# Altium schematic sheet SOM_JB1.SchDoc: SoM TE0720 JB1
size 420 x 297 mm; Author: P. Zdunek; DrawnBy: P. Zdunek; Organization: Altium Limited; Address1: L3, 12a Rodborough Rd; Address2: Frenchs Forest; Address3: NSW; Address4: Australia 2086; DocumentNumber: 3; SheetNumber: 3; SheetTotal: 37; ModifiedBy: -; CheckedDate: -; Title2: Fast Stabilizer; DivGrp: WUT ISE; Designer: G.Kasprowicz
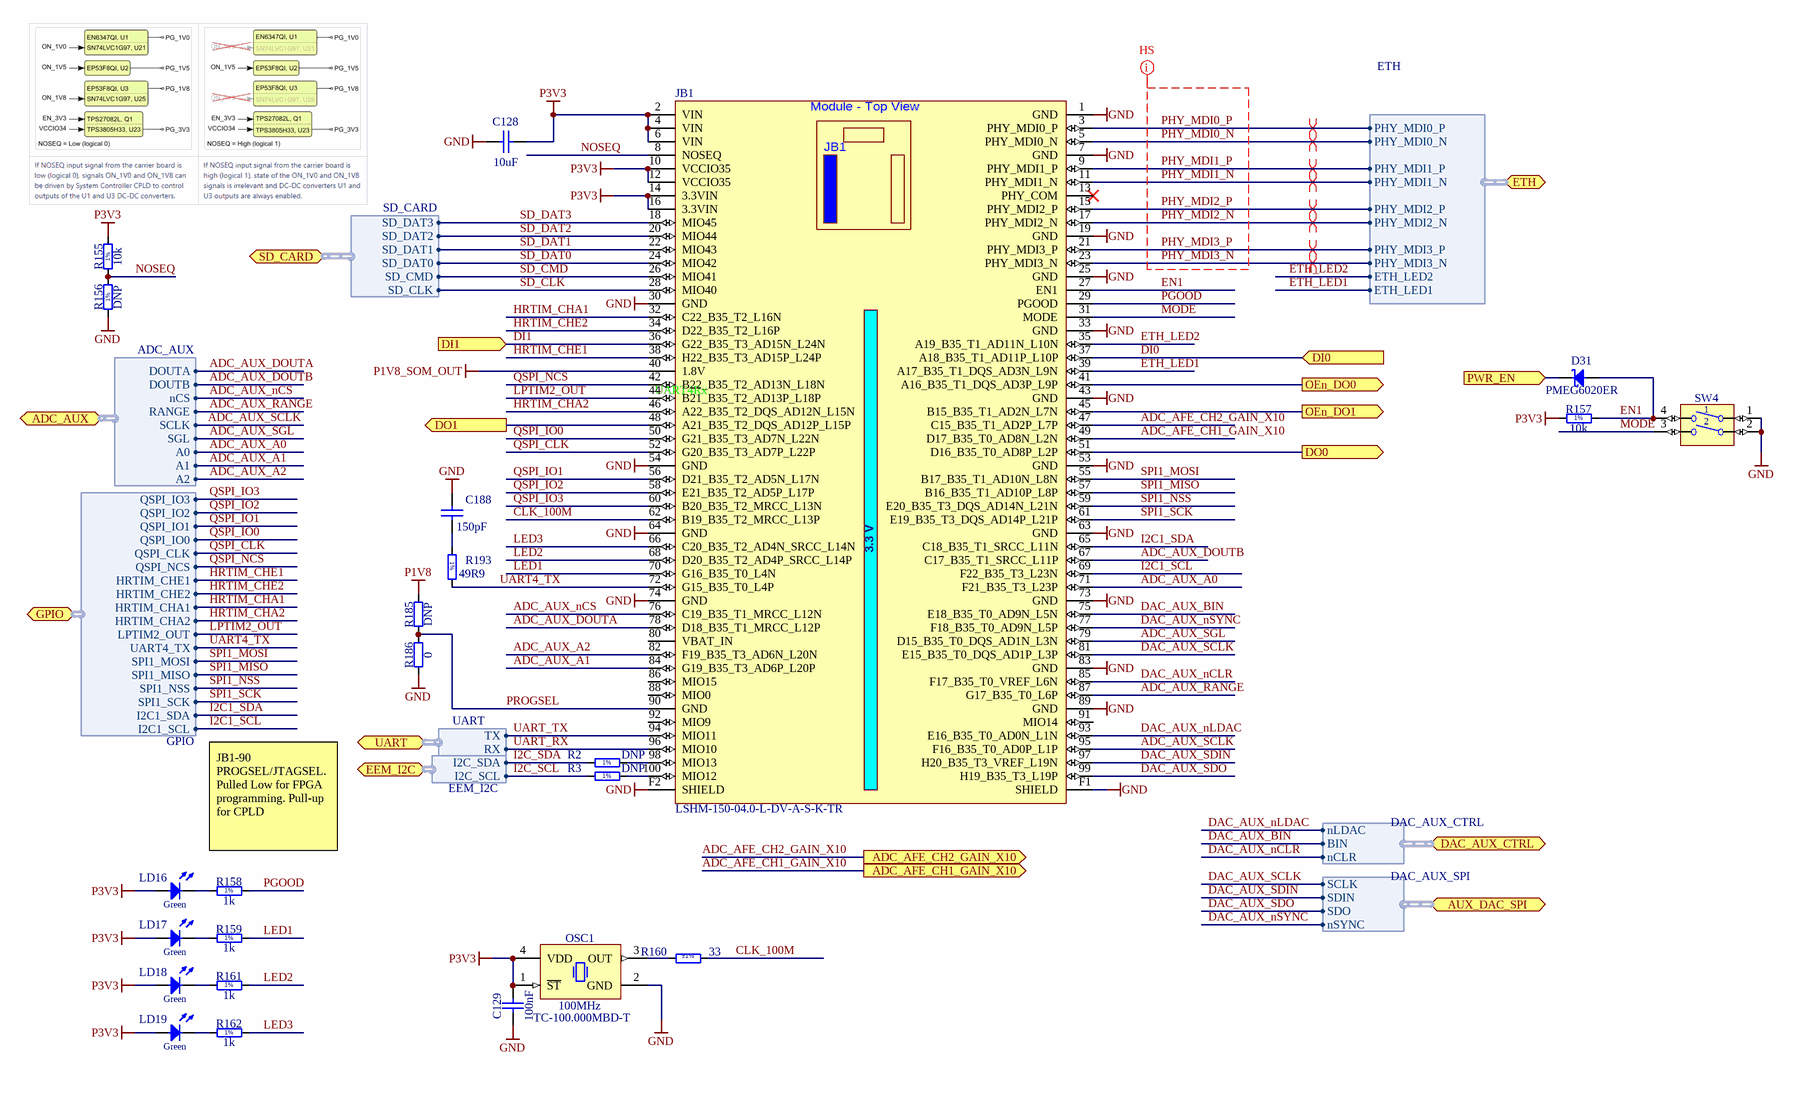
[diagram p0: SOM_JB1.SchDoc]

## Parts
C128  10uF  [CAPC1608X80N]
C129  100nF  [CAPC1005X55N]
C188  150pF  [CAPC1005X55N]
D31  PMEG6020ER  [SODFL3517X110N]
JB1  LSHM-150-04.0-L-DV-A-S-K-TR  [LSHM-150-XXX-X-DV-A-X]
LD16  Green  [LED_KINGBRIGHT_KPH-1608CGCK]
LD17  Green  [LED_KINGBRIGHT_KPH-1608CGCK]
LD18  Green  [LED_KINGBRIGHT_KPH-1608CGCK]
LD19  Green  [LED_KINGBRIGHT_KPH-1608CGCK]
OSC1  100MHz  Manufacturer Part Number: TC-100.000MBD-T  [OSC_CDFN3225-4LD-PL-1]
R2  DNP  [RESC1005X40N]
R3  DNP  [RESC1005X40N]
R155  10k  [RESC1005X40N]
R156  DNP  [RESC1005X40N]
R157  10k  [RESC1005X40N]
R158  1k  [RESC1005X40N]
R159  1k  [RESC1005X40N]
R160  33  Tolerance: ±1%  [RESC1005X40N]
R161  1k  [RESC1005X40N]
R162  1k  [RESC1005X40N]
R185  DNP  [RESC1005X40N]
R186  0  [RESC1005X40N]
R193  49R9  [RESC1005X40N]
SW4  Switch  [SW_OMRON_A6SN-2101]  (value not drawn)

## Ports
ADC_AFE_CH1_GAIN_X10 (out), ADC_AFE_CH2_GAIN_X10 (out), ADC_AUX (bidir, harness ADC_AUX), AUX_DAC_SPI (bidir, harness DAC_AUX_SPI), DAC_AUX_CTRL (bidir, harness DAC_AUX_CTRL), DI0 (in), DI1 (in), DO0 (out), DO1 (out), EEM_I2C (bidir, harness EEM_I2C), ETH (bidir, harness ETH), GPIO (bidir, harness GPIO), OEn_DO0 (out), OEn_DO1 (out), PWR_EN (in), SD_CARD (bidir, harness SD_CARD), UART (bidir, harness UART)

## Harnesses
ETH: PHY_MDI0_P, PHY_MDI0_N, PHY_MDI1_P, PHY_MDI1_N, PHY_MDI2_P, PHY_MDI2_N, PHY_MDI3_P, PHY_MDI3_N, ETH_LED2, ETH_LED1
SD_CARD: SD_DAT3, SD_DAT2, SD_DAT1, SD_DAT0, SD_CMD, SD_CLK
EEM_I2C: I2C_SDA, I2C_SCL
UART: TX, RX
ADC_AUX: SCLK, SGL, DOUTA, DOUTB, nCS, RANGE, A0, A1, A2
GPIO: QSPI_IO3, QSPI_IO2, QSPI_IO1, QSPI_IO0, QSPI_CLK, QSPI_NCS, HRTIM_CHE1, HRTIM_CHE2, HRTIM_CHA1, HRTIM_CHA2, LPTIM2_OUT, UART4_TX, SPI1_MOSI, SPI1_MISO, SPI1_NSS, SPI1_SCK, I2C1_SDA, I2C1_SCL
DAC_AUX_SPI: SCLK, SDIN, SDO, nSYNC
DAC_AUX_CTRL: nCLR, BIN, nLDAC

## Nets
GND: C128.2 C129.1 C188.2 JB1.1(GND) JB1.7(GND) JB1.19(GND) JB1.25(GND) JB1.30(GND) JB1.33(GND) JB1.43(GND) JB1.53(GND) JB1.54(GND) JB1.63(GND) JB1.64(GND) JB1.73(GND) JB1.74(GND) JB1.83(GND) JB1.89(GND) JB1.F1(SHIELD) JB1.F2(SHIELD) OSC1.2(GND) R156.1 R186.1 SW4.1 SW4.2
P1V8: R185.2
P1V8_SOM_OUT: JB1.40(1.8V)
P3V3: C128.1 C129.2 JB1.2(VIN) JB1.4(VIN) JB1.6(VIN) JB1.10(VCCIO35) JB1.12(VCCIO35) JB1.14(3.3VIN) JB1.16(3.3VIN) LD16.2(A) LD17.2(A) LD18.2(A) LD19.2(A) OSC1.1(~{ST}) OSC1.4(VDD) R155.2 R157.2
ADC_AFE_CH1_GAIN_X10: JB1.49(D17_B35_T0_AD8N_L2N) ; port ADC_AFE_CH1_GAIN_X10
ADC_AFE_CH2_GAIN_X10: JB1.47(C15_B35_T1_AD2P_L7P) ; port ADC_AFE_CH2_GAIN_X10
ADC_AUX_A0: JB1.71(F21_B35_T3_L23P) ; port ADC_AUX.A0
ADC_AUX_A1: JB1.84(G19_B35_T3_AD6P_L20P) ; port ADC_AUX.A1
ADC_AUX_A2: JB1.82(F19_B35_T3_AD6N_L20N) ; port ADC_AUX.A2
ADC_AUX_DOUTA: JB1.78(D18_B35_T1_MRCC_L12P) ; port ADC_AUX.DOUTA
ADC_AUX_DOUTB: JB1.67(C17_B35_T1_SRCC_L11P) ; port ADC_AUX.DOUTB
ADC_AUX_nCS: JB1.76(C19_B35_T1_MRCC_L12N) ; port ADC_AUX.nCS
ADC_AUX_RANGE: JB1.87(G17_B35_T0_L6P) ; port ADC_AUX.RANGE
ADC_AUX_SCLK: JB1.95(F16_B35_T0_AD0P_L1P) ; port ADC_AUX.SCLK
ADC_AUX_SGL: JB1.79(D15_B35_T0_DQS_AD1N_L3N) ; port ADC_AUX.SGL
CLK_100M: JB1.62(B19_B35_T2_MRCC_L13P) R160.2
DAC_AUX_BIN: JB1.75(E18_B35_T0_AD9N_L5N) ; port DAC_AUX_CTRL.BIN
DAC_AUX_nCLR: JB1.85(F17_B35_T0_VREF_L6N) ; port DAC_AUX_CTRL.nCLR
DAC_AUX_nLDAC: JB1.93(E16_B35_T0_AD0N_L1N) ; port DAC_AUX_CTRL.nLDAC
DAC_AUX_nSYNC: JB1.77(F18_B35_T0_AD9N_L5P) ; port AUX_DAC_SPI.nSYNC
DAC_AUX_SCLK: JB1.81(E15_B35_T0_DQS_AD1P_L3P) ; port AUX_DAC_SPI.SCLK
DAC_AUX_SDIN: JB1.97(H20_B35_T3_VREF_L19N) ; port AUX_DAC_SPI.SDIN
DAC_AUX_SDO: JB1.99(H19_B35_T3_L19P) ; port AUX_DAC_SPI.SDO
DI0: JB1.37(A18_B35_T1_AD11P_L10P) ; port DI0
DI1: JB1.36(G22_B35_T3_AD15N_L24N) ; port DI1
DO0: JB1.51(D16_B35_T0_AD8P_L2P) ; port DO0
DO1: JB1.48(A21_B35_T2_DQS_AD12P_L15P) ; port DO1
EN1: D31.2(A) JB1.27(EN1) R157.1 SW4.4
ETH_LED1: JB1.39(A17_B35_T1_DQS_AD3N_L9N) ; port ETH.ETH_LED1
ETH_LED2: JB1.35(A19_B35_T1_AD11N_L10N) ; port ETH.ETH_LED2
HRTIM_CHA1: JB1.32(C22_B35_T2_L16N) ; port GPIO.HRTIM_CHA1
HRTIM_CHA2: JB1.46(A22_B35_T2_DQS_AD12N_L15N) ; port GPIO.HRTIM_CHA2
HRTIM_CHE1: JB1.38(H22_B35_T3_AD15P_L24P) ; port GPIO.HRTIM_CHE1
HRTIM_CHE2: JB1.34(D22_B35_T2_L16P) ; port GPIO.HRTIM_CHE2
I2C1_SCL: JB1.69(F22_B35_T3_L23N) ; port GPIO.I2C1_SCL
I2C1_SDA: JB1.65(C18_B35_T1_SRCC_L11N) ; port GPIO.I2C1_SDA
I2C_SCL: R3.1 ; port EEM_I2C.I2C_SCL
I2C_SDA: R2.1 ; port EEM_I2C.I2C_SDA
LED1: JB1.70(G16_B35_T0_L4N) R159.2
LED2: JB1.68(D20_B35_T2_AD4P_SRCC_L14P) R161.2
LED3: JB1.66(C20_B35_T2_AD4N_SRCC_L14N) R162.2
LPTIM2_OUT: JB1.44(B21_B35_T2_AD13P_L18P) ; port GPIO.LPTIM2_OUT
MODE: JB1.31(MODE) SW4.3
NOSEQ: JB1.8(NOSEQ) R155.1 R156.2
OEn_DO0: JB1.41(A16_B35_T1_DQS_AD3P_L9P) ; port OEn_DO0
OEn_DO1: JB1.45(B15_B35_T1_AD2N_L7N) ; port OEn_DO1
PGOOD: JB1.29(PGOOD) R158.2
PHY_MDI0_N: JB1.5(PHY_MDI0_N) ; port ETH.PHY_MDI0_N
PHY_MDI0_P: JB1.3(PHY_MDI0_P) ; port ETH.PHY_MDI0_P
PHY_MDI1_N: JB1.11(PHY_MDI1_N) ; port ETH.PHY_MDI1_N
PHY_MDI1_P: JB1.9(PHY_MDI1_P) ; port ETH.PHY_MDI1_P
PHY_MDI2_N: JB1.17(PHY_MDI2_N) ; port ETH.PHY_MDI2_N
PHY_MDI2_P: JB1.15(PHY_MDI2_P) ; port ETH.PHY_MDI2_P
PHY_MDI3_N: JB1.23(PHY_MDI3_N) ; port ETH.PHY_MDI3_N
PHY_MDI3_P: JB1.21(PHY_MDI3_P) ; port ETH.PHY_MDI3_P
PROGSEL: JB1.90(GND) R185.1 R186.2
PWR_EN: D31.1(C) ; port PWR_EN
QSPI_CLK: JB1.52(G20_B35_T3_AD7P_L22P) ; port GPIO.QSPI_CLK
QSPI_IO0: JB1.50(G21_B35_T3_AD7N_L22N) ; port GPIO.QSPI_IO0
QSPI_IO1: JB1.56(D21_B35_T2_AD5N_L17N) ; port GPIO.QSPI_IO1
QSPI_IO2: JB1.58(E21_B35_T2_AD5P_L17P) ; port GPIO.QSPI_IO2
QSPI_IO3: JB1.60(B20_B35_T2_MRCC_L13N) ; port GPIO.QSPI_IO3
QSPI_NCS: JB1.42(B22_B35_T2_AD13N_L18N) ; port GPIO.QSPI_NCS
SD_CLK: JB1.28(MIO40) ; port SD_CARD.SD_CLK
SD_CMD: JB1.26(MIO41) ; port SD_CARD.SD_CMD
SD_DAT0: JB1.24(MIO42) ; port SD_CARD.SD_DAT0
SD_DAT1: JB1.22(MIO43) ; port SD_CARD.SD_DAT1
SD_DAT2: JB1.20(MIO44) ; port SD_CARD.SD_DAT2
SD_DAT3: JB1.18(MIO45) ; port SD_CARD.SD_DAT3
SPI1_MISO: JB1.57(B16_B35_T1_AD10P_L8P) ; port GPIO.SPI1_MISO
SPI1_MOSI: JB1.55(B17_B35_T1_AD10N_L8N) ; port GPIO.SPI1_MOSI
SPI1_NSS: JB1.59(E20_B35_T3_DQS_AD14N_L21N) ; port GPIO.SPI1_NSS
SPI1_SCK: JB1.61(E19_B35_T3_DQS_AD14P_L21P) ; port GPIO.SPI1_SCK
UART4_TX: JB1.72(G15_B35_T0_L4P) R193.2 ; port GPIO.UART4_TX
UART_RX: JB1.96(MIO10) ; port UART.RX
UART_TX: JB1.94(MIO11) ; port UART.TX
NetC188_1: C188.1 R193.1
NetJB1_98: JB1.98(MIO13) R2.2
NetJB1_100: JB1.100(MIO12) R3.2
NetLD16_1: LD16.1(C) R158.1
NetLD17_1: LD17.1(C) R159.1
NetLD18_1: LD18.1(C) R161.1
NetLD19_1: LD19.1(C) R162.1
NetOSC1_3: OSC1.3(OUT) R160.1

Not connected (* = marked no-connect by the designer): JB1 13(PHY_COM)* 80(VBAT_IN) 86(MIO15) 88(MIO0) 91(MIO14) 92(MIO9)

## Layout directives
differential pair: PHY_MDI0_N, PHY_MDI0_P, PHY_MDI1_N, PHY_MDI1_P, PHY_MDI2_N, PHY_MDI2_P, PHY_MDI3_N, PHY_MDI3_P
net class HIGH_SPEED: PHY_MDI0_N, PHY_MDI0_P, PHY_MDI1_N, PHY_MDI1_P, PHY_MDI2_N, PHY_MDI2_P, PHY_MDI3_N, PHY_MDI3_P

## Notes on the sheet
- (near JB1) UART4Rx
- (near JB1) 3.3 V
- JB1-90 PROGSEL/JTAGSEL. Pulled Low for FPGA programming. Pull-up for CPLD
- Project/Equipment
- Document
- Designer
- Drawn by
- Check.by
- Copyright WUT ISE 2020.
  This documentation describes Open Hardware and is licensed under the CERN OHL v.1.2. You may redistribute and modify this documentation under the terms of the CERN OHL v.1.2. (http://ohwr.org/CERNOHL). This documentation is distributed WITHOUT ANY EXPRESS OR IMPLIED WARRANTY, INCLUDING OF MERCHANTABILITY, SATISFACTORY QUALITY AND FITNESS FOR A PARTICULAR PURPOSE. Please see the CERN OHL v.1.2 for applicable conditions.
- Contact
- File
- Last Mod.
- Print Date
- Sheet
- Size
- A3
- of
- Rev
- (in symbol 25285) Module - Top View
- (in symbol R0402_1K_1%_0.0625W_100PPM) 1%
- (in symbol R0402_2K4_1%_0.0625W_100PPM) 1%
- (in symbol R0402_10K_1%_0.0625W_100PPM) 1%
- (in symbol R0402_49R9_1%_0.0625W_100PPM) 1%

## Library data of the parts
C128 = CC0603_10UF_10V_10%_X5R: Non-polarised capacitor; Part Description: SMD Multilayer Chip Ceramic Capacitor; Manufacturer: GENERIC; Manufacturer1 Part Number: GRM188R61A106KE69D; Voltage: 10V; TC: X5R; Tolerance: ±10%; Part Number: CC0603_10UF_10V_10%_X5R; Component Kind: Standard; Component Type: Standard; Pin Count: 2; Value: 10uF; Status: None; Manufacturer Part Number: CC0603_10UF_10V_10%_X5R; Case: 0603; Mounted: Yes; Socket: No; SMD: Yes; Sense: No; Manufacturer1 Example: MURATA; Manufacturer1 ComponentHeight: 0.8mm; HelpURL: \\cern.ch\dfs\Applications\Altium\Datasheets\CC0603_MURATA_GRM188R61A106KE69D.pdf; Author: CERN DEM JLC; CreateDate: 31/01/2017; LatestRevisionDate: 31/01/2017
C129 = CC0402_100NF_16V_10%_X5R: Non-polarised capacitor; Manufacturer: GENERIC; Part Description: SMD Multilayer Chip Ceramic Capacitor; Manufacturer1 Part Number: GRM155R61C104KA88D; Voltage: 16V; TC: X5R; Tolerance: ±10%; Part Number: CC0402_100NF_16V_10%_X5R; Component Kind: Standard; Component Type: Standard; Pin Count: 2; Value: 100nF; Status: None; Manufacturer Part Number: CC0402_100NF_16V_10%_X5R; Case: 0402; Mounted: Yes; Socket: No; SMD: Yes; Sense: No; Manufacturer1 Example: MURATA; Manufacturer1 ComponentHeight: 0.55mm; HelpURL: \\cern.ch\dfs\Applications\Altium\Datasheets\CC0402_X5R_MURATA_GRM.pdf; Author: CERN DEM JLC; CreateDate: 10/12/2013; LatestRevisionDate: 10/12/2013
C188 = CC0402_150PF_50V_5%_C0G: Non-polarised capacitor; Part Description: SMD Multilayer Chip Ceramic Capacitor; Manufacturer: GENERIC; Manufacturer1 Part Number: C0402C151J5GACTU; Voltage: 50V; TC: C0G/NP0; Tolerance: ±5%; Part Number: CC0402_150PF_50V_5%_C0G; Component Kind: Standard; Component Type: Standard; Pin Count: 2; Value: 150pF; Status: Preferred; Manufacturer Part Number: CC0402_150PF_50V_5%_C0G; Case: 0402; Mounted: Yes; Socket: No; SMD: Yes; Sense: No; Manufacturer1 Example: KEMET; Manufacturer1 ComponentHeight: 0.55mm; HelpURL: \\cern.ch\dfs\Applications\Altium\Datasheets\CC0402_C0G_KEMET_(Commercial Grade).pdf; Author: CERN DEM JLC; CreateDate: 03.12.2007; LatestRevisionDate: 22.04.2015
D31 = PMEG6020ER: Schottky Diode; Part Description: MEGA Schottky Barrier Rectifier; Manufacturer: NXP SEMICONDUCTORS; Voltage: 60V; Power: 2A; PressFit: No; Bonding: No; Part Number: PMEG6020ER; Component Kind: Standard; Component Type: Standard; Device: PMEG6020ER; PackageDescription: SODFL Diode (SOD123W); 2.60mm W X 1.70mm L X 1.10mm H body, IPC Medium Density; Manufacturer Part Number: PMEG6020ER; Pin Count: 2; Case: SOD-123FL; Mounted: Yes; Socket: No; SMD: Yes; Sense: No; ComponentHeight: 1.1mm; HelpURL: \\cern.ch\dfs\Applications\Altium\Datasheets\PMEG6020ER.pdf; Author: CERN DEM JMW; CreateDate: 19.06.2014; LatestRevisionDate: 19.06.2014
JB1 = 25285: Samtec Razor Beam REF-189016-02, LF-04.0, 100 Pins, für alle 4x5 SoMs; Mixed: SMT; Trenz-Stock: Yes; Trenz-Article-Number: 23838; AN: 25285; Part Number: LSHM-150-04.0-L-DV-A-S-K-TR
LD16-LD19 = LED_KINGBRIGHT_KPH-1608CGCK: LED Green 1C 2A; Part Description: SMD Green LED, Case 1.6mmX0.8mm(0603), 0.65mm Thickness; PressFit: No; Bonding: No; Part Number: LED_KINGBRIGHT_KPH-1608CGCK; Component Kind: Standard; Component Type: Standard; Color: Green; PackageDescription: SMT Green LED, Case 0603, Body L 1.6 x W 0.8mm H 0.65mm; Manufacturer: KINGBRIGHT; Manufacturer Part Number: KPH-1608CGCK; Pin Count: 2; Mounted: Yes; Socket: No; SMD: Yes; Sense: No; ComponentHeight: 0.65mm; HelpURL: \\cern.ch\dfs\Applications\Altium\Datasheets\LED_KINGBRIGHT_KPH-1608CGCK.pdf; Author: CERN DEM JLC; CreateDate: 03/07/2017; LatestRevisionDate: 03/07/2017
OSC1 = OSC_TC-100.000MBD-T: Oscillator MEMS 100MHz ±25ppm; Part Description: 1.8V-3.3V, ±25ppm, 15pF, -40..105°C, Surface Mount Low-Power Precision MEMS Oscillator; Manufacturer: TXC; PressFit: No; Bonding: No; Part Number: TC-100.000MBD-T; Component Kind: Standard; Component Type: Standard; Footprint: CDFN3225-4LD-PL-1; PackageDescription: DFN, 4 pins, 3.2mm x 2.5mm; Value: 100MHz; Pin Count: 4; Mounted: Yes; Socket: No; SMD: Yes; Sense: No; ComponentHeight: 0.9mm; HelpURL: \\cern.ch\dfs\Applications\Altium\Datasheets\OSC_MICROCHIP_DSC1001.pdf; Author: GK; CreateDate: 24.02.2021; LatestRevisionDate: 24.02.2021
R2 R3 = R0402_2K4_1%_0.0625W_100PPM: Resistor - 1%; Part Description: General Purpose Thick Film Chip Resistor; Manufacturer: GENERIC; Manufacturer1 Part Number: 232270672402L; Value: 2k4; TC: ±100ppm/°C; PressFit: No; Part Number: R0402_2K4_1%_0.0625W_100PPM; Component Kind: Standard; Component Type: Standard; Pin Count: 2; Status: Not Recommended; Power: 0.0625W; Tolerance: ±1%; Manufacturer Part Number: R0402_2K4_1%_0.0625W_100PPM; Case: 0402; Mounted: Yes; Sense: No; Socket: No; SMD: Yes; Manufacturer1 Example: YAGEO PHYCOMP; Manufacturer1 ComponentHeight: 0.4mm; HelpURL: \\cern.ch\dfs\Applications\Altium\Datasheets\R0402_Phycomp_RC0402.pdf; Author: CERN DEM JLC; CreateDate: 03.12.2007; LatestRevisionDate: 17.10.2012
R155 R157 = R0402_10K_1%_0.0625W_100PPM: Resistor - 1%; Part Description: General Purpose Thick Film Chip Resistor; Manufacturer: GENERIC; Manufacturer1 Part Number: 232270671003L; PressFit: No; TC: ±100ppm/°C; Part Number: R0402_10K_1%_0.0625W_100PPM; Component Kind: Standard; Component Type: Standard; Pin Count: 2; Value: 10k; Status: Not Recommended; Manufacturer Part Number: R0402_10K_1%_0.0625W_100PPM; Case: 0402; Mounted: Yes; Sense: No; Socket: No; SMD: Yes; Manufacturer1 Example: YAGEO PHYCOMP; Manufacturer1 ComponentHeight: 0.4mm; HelpURL: \\cern.ch\dfs\Applications\Altium\Datasheets\R0402_Phycomp_RC0402.pdf; Author: CERN DEM JLC; CreateDate: 03-Dec-07; LatestRevisionDate: 17-Oct-12; Power: 0.0625W; Tolerance: ±1%
R156 = R0402_10K_1%_0.0625W_100PPM: Resistor - 1%; Part Description: General Purpose Thick Film Chip Resistor; Manufacturer: GENERIC; Manufacturer1 Part Number: 232270671003L; Value: 10k; PressFit: No; TC: ±100ppm/°C; Part Number: R0402_10K_1%_0.0625W_100PPM; Component Kind: Standard; Component Type: Standard; Pin Count: 2; Status: Not Recommended; Manufacturer Part Number: R0402_10K_1%_0.0625W_100PPM; Case: 0402; Mounted: Yes; Sense: No; Socket: No; SMD: Yes; Manufacturer1 Example: YAGEO PHYCOMP; Manufacturer1 ComponentHeight: 0.4mm; HelpURL: \\cern.ch\dfs\Applications\Altium\Datasheets\R0402_Phycomp_RC0402.pdf; Author: CERN DEM JLC; CreateDate: 03-Dec-07; LatestRevisionDate: 17-Oct-12; Power: 0.0625W; Tolerance: ±1%
R158 R159 R161 R162 = R0402_1K_1%_0.0625W_100PPM: Resistor - 1%; Part Description: General Purpose Thick Film Chip Resistor; Manufacturer: GENERIC; Manufacturer1 Part Number: 232270671002L; TC: ±100ppm/°C; PressFit: No; Part Number: R0402_1K_1%_0.0625W_100PPM; Component Kind: Standard; Component Type: Standard; Pin Count: 2; Value: 1k; Status: Not Recommended; Power: 0.0625W; Tolerance: ±1%; Manufacturer Part Number: R0402_1K_1%_0.0625W_100PPM; Case: 0402; Mounted: Yes; Sense: No; Socket: No; SMD: Yes; Manufacturer1 Example: YAGEO PHYCOMP; Manufacturer1 ComponentHeight: 0.4mm; HelpURL: \\cern.ch\dfs\Applications\Altium\Datasheets\R0402_Phycomp_RC0402.pdf; Author: CERN DEM JLC; CreateDate: 03.12.2007; LatestRevisionDate: 17.10.2012
R160 = R0402_33R_1%_0.0625W_100PPM: Resistor - 1%; Part Description: General Purpose Thick Film Chip Resistor; Manufacturer: GENERIC; Manufacturer1 Part Number: 232270673309L; TC: ±100ppm/°C; PressFit: No; Part Number: R0402_33R_1%_0.0625W_100PPM; Component Kind: Standard; Component Type: Standard; Pin Count: 2; Value: 33; Status: Not Recommended; Power: 0.0625W; Manufacturer Part Number: R0402_33R_1%_0.0625W_100PPM; Case: 0402; Mounted: Yes; Sense: No; Socket: No; SMD: Yes; Manufacturer1 Example: YAGEO PHYCOMP; Manufacturer1 ComponentHeight: 0.4mm; HelpURL: \\cern.ch\dfs\Applications\Altium\Datasheets\R0402_Phycomp_RC0402.pdf; Author: CERN DEM JLC; CreateDate: 03.12.2007; LatestRevisionDate: 17.10.2012
R185 = R0402_0R_JUMPER: Resistor; Part Description: 1A (0.05R Max DC Resistance) Zero Ohm Jumper; Manufacturer: GENERIC; Manufacturer1 Part Number: 232270591001L; Value: 0; PressFit: No; Part Number: R0402_0R_JUMPER; Component Kind: Standard; Component Type: Standard; Pin Count: 2; Status: Not Recommended; Manufacturer Part Number: R0402_0R_JUMPER; Case: 0402; Mounted: Yes; Sense: No; Socket: No; SMD: Yes; Manufacturer1 Example: YAGEO PHYCOMP; Manufacturer1 ComponentHeight: 0.4mm; HelpURL: \\cern.ch\dfs\Applications\Altium\Datasheets\R0402_Phycomp_RC0402.pdf; Author: CERN DEM JLC; CreateDate: 03/12/2007; LatestRevisionDate: 17/10/2012
R186 = R0402_0R_JUMPER: Resistor; Part Description: 1A (0.05R Max DC Resistance) Zero Ohm Jumper; Manufacturer: GENERIC; Manufacturer1 Part Number: 232270591001L; PressFit: No; Part Number: R0402_0R_JUMPER; Component Kind: Standard; Component Type: Standard; Pin Count: 2; Value: 0; Status: Not Recommended; Manufacturer Part Number: R0402_0R_JUMPER; Case: 0402; Mounted: Yes; Sense: No; Socket: No; SMD: Yes; Manufacturer1 Example: YAGEO PHYCOMP; Manufacturer1 ComponentHeight: 0.4mm; HelpURL: \\cern.ch\dfs\Applications\Altium\Datasheets\R0402_Phycomp_RC0402.pdf; Author: CERN DEM JLC; CreateDate: 03/12/2007; LatestRevisionDate: 17/10/2012
R193 = R0402_49R9_1%_0.0625W_100PPM: Resistor - 1%; Part Description: General Purpose Thick Film Chip Resistor; Manufacturer: GENERIC; Manufacturer1 Part Number: 232270674999L or RC0402FR-0749R9L; TC: ±100ppm/°C; Table: Resistors SMD; Part Number: R0402_49R9_1%_0.0625W_100PPM; Component Kind: Standard; Component Type: Standard; Pin Count: 2; Value: 49R9; Status: Not recommended; Power: 0.0625W; Tolerance: ±1%; Manufacturer Part Number: R0402_49R9_1%_0.0625W_100PPM; Case: 0402; Mounted: Yes; Socket: No; SMD: Yes; Manufacturer1 Example: YAGEO PHYCOMP; Manufacturer1 ComponentHeight: 0.4mm; HelpURL: \\cern.ch\dfs\Applications\Altium\Datasheets\R0402_Phycomp_RC0402.pdf; Author: CERN DEM JLC; CreateDate: 2012-10-24; LatestRevisionDate: 2012-10-24
SW4 = SW_OMRON_A6SN-2101: 2 Ways SPST DIP Switch; Part Description: 2 Ways SPST Surface-Mounting Slide Switch With Flat Actuator, Contact Rating 25mA 24VDC; Manufacturer: OMRON; PressFit: No; Part Number: SW_OMRON_A6SN-2101; Component Kind: Standard; Component Type: Standard; Pin Count: 4; PackageDescription: Pitch 2.54mm, Body 7x7.5, 2 Ways SPST Surface-Mounting Slide Switch With Flat Actuator (A6SN Series); Family: Switch; Mounted: Yes; Socket: No; SMD: Yes; Sense: No; Status: None; Manufacturer Part Number: A6SN-2101; ComponentHeight: 4.6mm; HelpURL: \\cern.ch\dfs\Applications\Altium\Datasheets\SW_OMRON_A6SN-2101.pdf; Author: CERN DEM MR; CreateDate: 04-Nov-16; LatestRevisionDate: 04-Nov-16